# EAGLE design esp01-shield (EAGLE 7.6.0)
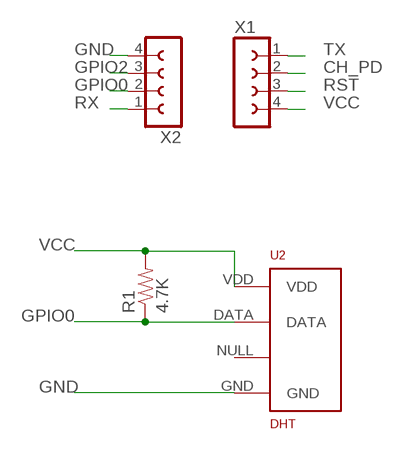
[diagram p0: schematic, sheet 1]

## Parts
R1  4.7K  RESISTORPTH-1/6W  [1/6W-RES]
U2  DHT  RHT03_DHT-22_AM2302  [RHT03_DHT-22]
X1  SPB4  [SPB4]
X2  SPB4  [SPB4]

## Nets
CH_PD: X1.2
GND: U2.GND X2.4
GPIO0: R1.1 U2.DATA X2.2
GPIO2: X2.3
RST: X1.3
RX: X2.1
TX: X1.1
VCC: R1.2 U2.VDD X1.4
Unconnected: U2.NULL

## Library data of the parts
R1 = SparkFun-Passives:RESISTOR: Resistor Basic schematic elements and footprints for 0603, 1206, and PTH resistors.
U2 = RHT03_DHT-22_AM2302:RHT03_DHT-22_AM2302: RHT03 / DHT-22 / AM2302 Packages and symbol for the RHT03 / DHT-22 relative humidity and temperature sensor. Note: The AM2302 is a wired version of the DHT-22 which typically requires less clearance and is thus provided as a separate package.; PROD_ID: SEN-10167
X1 X2 = con-hirschmann:SPB4: CONNECTOR 4 pins; OC_FARNELL: unknown; OC_NEWARK: unknown

## Board
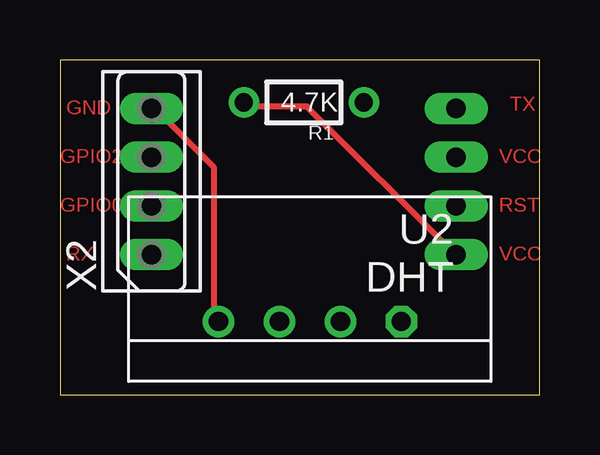
[diagram p1: board, top side]
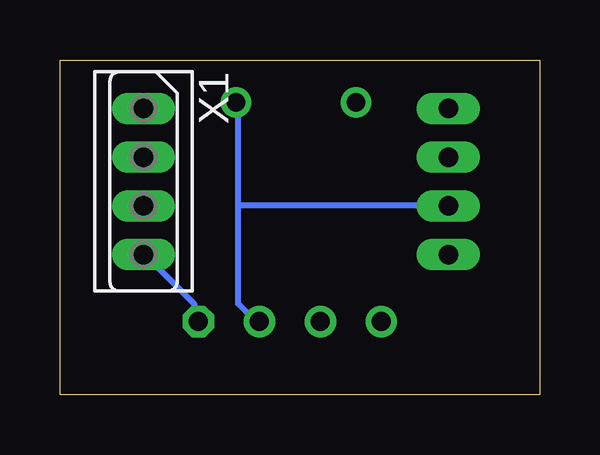
[diagram p2: board, bottom side, seen from below]

Size 19.99 x 13.96 mm. Coordinates in mm from the lower left corner, seen from the top.
Outline: 0,0 19.99,0 19.99,13.96 0,13.96 0,0
Copper layers (1*16): Top 0.035mm / dielectric 1.5mm / Bottom 0.035mm
Design rules "default": minimum track width 10mil, minimum drill 24mil, track to track 8mil, track to pad 8mil, pad to pad 8mil, via to via 8mil, smd to smd 8mil, copper to edge 40mil, drill to drill 8mil, minimum pad ring 10mil, minimum via ring 8mil, stop-mask expansion 4mil, vias tented up to drill 0mil, thermal gap 10mil

### Footprints (pad centres in the part's own frame; a part is rotated, then mirrored left to right if it is on the bottom)
1/6W-RES = drill 0.762: 1 -2.5,0; 2 2.5,0
RHT03_DHT-22 = drill 0.8: DATA -1.27,0; GND 3.81,0; NULL 1.27,0 | drill 0.8 octagon: VDD -3.81,0
SPB4 = drill 0.813 long: 1 -3.048,0; 2 -1.016,0; 3 1.016,0; 4 3.048,0

### Placement (x,y rotation side)
R1  10.16,12.19 180 top
U2  10.41,3.05 180 top
X1  16.51,8.89 270 bottom
X2  3.81,8.89 90 top

### Tracks (layer width: path | path; a pad name or v marks a point on that pad's centre or on a via)
GND
  Top 0.254: U2.GND 6.4,3.1 6.4,9.5 3.89,12.01 X2.4
GPIO0
  Bottom 0.254: 12.57,7.9 12.57,3.79 11.89,3.1 U2.DATA | 12.57,7.9 12.57,12.01 R1.1 | 12.57,7.9 3.89,7.9 X2.2
VCC
  Top 0.254: R1.2 7.77,12.01 10.29,12.01 16.46,5.84 X1.4
  Bottom 0.254: U2.VDD 14.4,3.1 14.4,3.79 16.46,5.84 X1.4

### Text on the board
Top: TX | GND | GPIO2 | VCC | GPIO0 | RST | RX | VCC